# EAGLE design backplane (EAGLE 5.06)
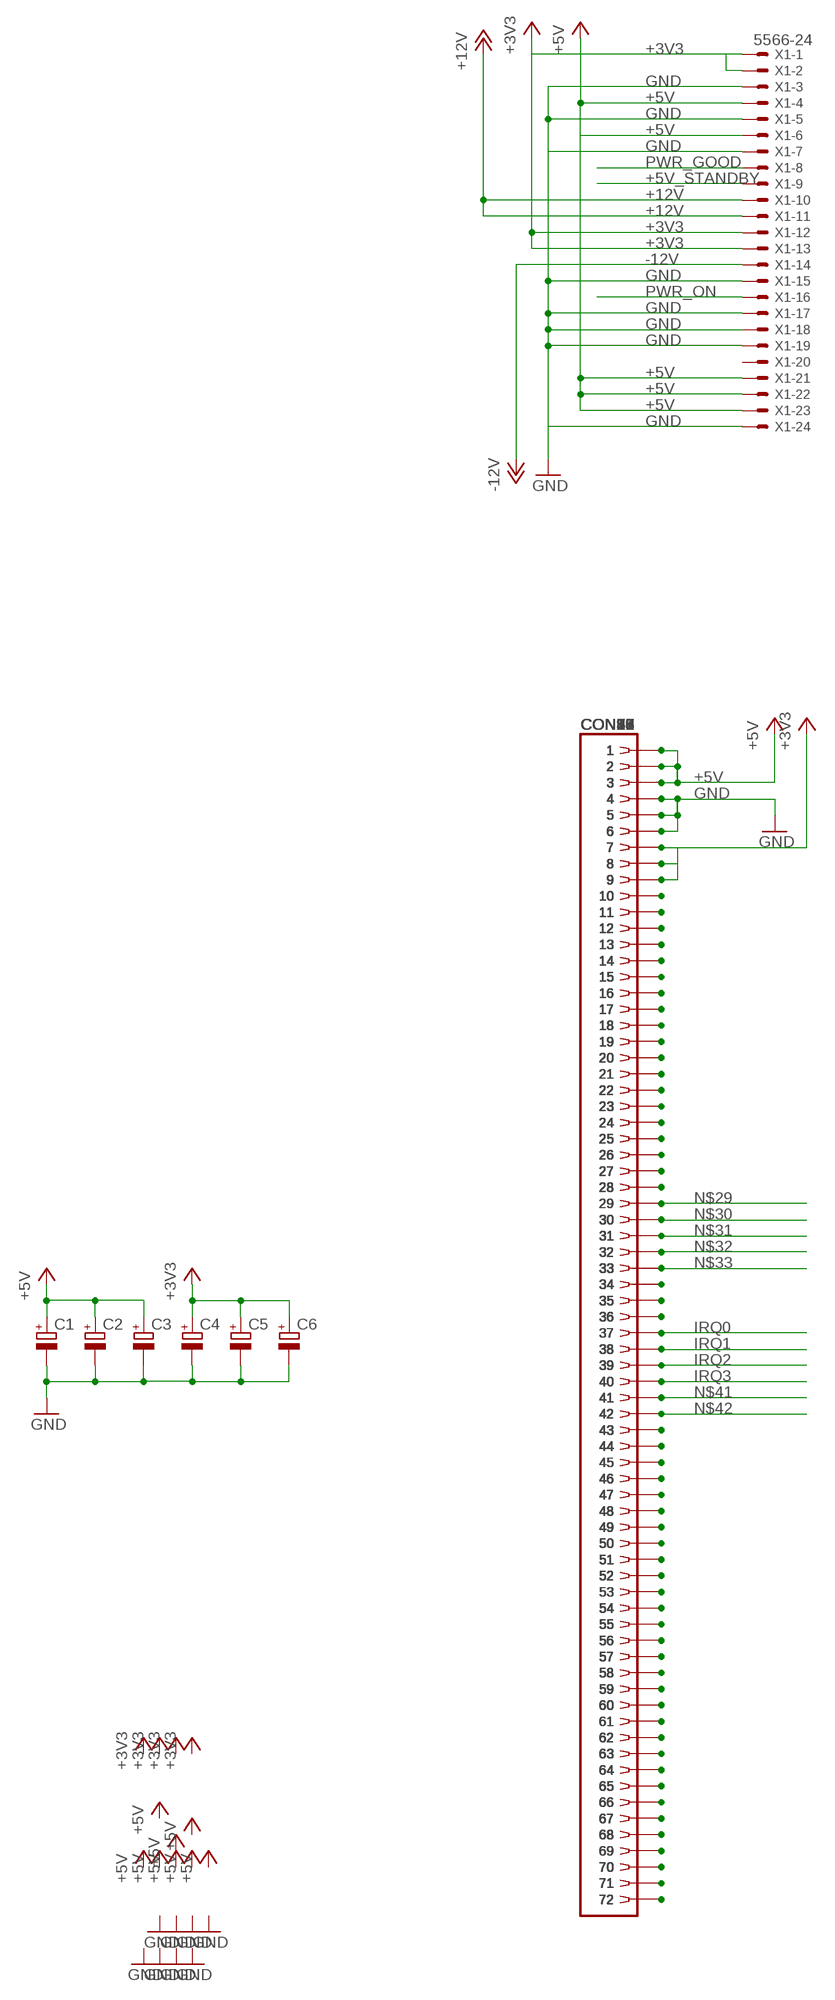
[diagram p0: schematic, sheet 1]

## Parts
C1  CPOL-EUE3.5-10  [E3,5-10]
C2  CPOL-EUE2.5-6  [E2,5-6]
C3  CPOL-EUE2.5-6  [E2,5-6]
C4  CPOL-EUE3.5-10  [E3,5-10]
C5  CPOL-EUE2.5-6  [E2,5-6]
C6  CPOL-EUE2.5-6  [E2,5-6]
CON1  SIMM72  [73826962]
CON2  SIMM72  [73826962]
CON3  SIMM72  [73826962]
CON4  SIMM72  [73826962]
CON5  SIMM72  [73826962]
CON6  SIMM72  [73826962]
CON7  SIMM72  [73826962]
CON8  SIMM72  [73826962]
CON9  SIMM72  [73826962]
CON10  SIMM72  [73826962]
CON11  SIMM72  [73826962]
CON12  SIMM72  [73826962]
CON13  SIMM72  [73826962]
CON14  SIMM72  [73826962]
CON15  SIMM72  [73826962]
CON16  SIMM72  [73826962]
CON17  SIMM72  [73826962]
CON18  SIMM72  [73826962]
CON19  SIMM72  [73826962]
CON20  SIMM72  [73826962]
X1  5566-24  [5566-24]

## Nets
+3V3: C4.+ C5.+ C6.+ CON1.7 CON1.8 CON1.9 CON2.7 CON2.8 CON2.9 CON3.7 CON3.8 CON3.9 CON4.7 CON4.8 CON4.9 CON5.7 CON5.8 CON5.9 CON6.7 CON6.8 CON6.9 CON7.7 CON7.8 CON7.9 CON8.7 CON8.8 CON8.9 CON9.7 CON9.8 CON9.9 CON10.7 CON10.8 CON10.9 CON11.7 CON11.8 CON11.9 CON12.7 CON12.8 CON12.9 CON13.7 CON13.8 CON13.9 CON14.7 CON14.8 CON14.9 CON15.7 CON15.8 CON15.9 CON16.7 CON16.8 CON16.9 CON17.7 CON17.8 CON17.9 CON18.7 CON18.8 CON18.9 CON19.7 CON19.8 CON19.9 CON20.7 CON20.8 CON20.9 X1.1 X1.2 X1.12 X1.13
+5V: C1.+ C2.+ C3.+ CON1.1 CON1.2 CON1.3 CON2.1 CON2.2 CON2.3 CON3.1 CON3.2 CON3.3 CON4.1 CON4.2 CON4.3 CON5.1 CON5.2 CON5.3 CON6.1 CON6.2 CON6.3 CON7.1 CON7.2 CON7.3 CON8.1 CON8.2 CON8.3 CON9.1 CON9.2 CON9.3 CON10.1 CON10.2 CON10.3 CON11.1 CON11.2 CON11.3 CON12.1 CON12.2 CON12.3 CON13.1 CON13.2 CON13.3 CON14.1 CON14.2 CON14.3 CON15.1 CON15.2 CON15.3 CON16.1 CON16.2 CON16.3 CON17.1 CON17.2 CON17.3 CON18.1 CON18.2 CON18.3 CON19.1 CON19.2 CON19.3 CON20.1 CON20.2 CON20.3 X1.4 X1.6 X1.21 X1.22 X1.23
+5V_STANDBY: X1.9
+12V: X1.10 X1.11
-12V: X1.14
GND: C1.- C2.- C3.- C4.- C5.- C6.- CON1.4 CON1.5 CON1.6 CON2.4 CON2.5 CON2.6 CON3.4 CON3.5 CON3.6 CON4.4 CON4.5 CON4.6 CON5.4 CON5.5 CON5.6 CON6.4 CON6.5 CON6.6 CON7.4 CON7.5 CON7.6 CON8.4 CON8.5 CON8.6 CON9.4 CON9.5 CON9.6 CON10.4 CON10.5 CON10.6 CON11.4 CON11.5 CON11.6 CON12.4 CON12.5 CON12.6 CON13.4 CON13.5 CON13.6 CON14.4 CON14.5 CON14.6 CON15.4 CON15.5 CON15.6 CON16.4 CON16.5 CON16.6 CON17.4 CON17.5 CON17.6 CON18.4 CON18.5 CON18.6 CON19.4 CON19.5 CON19.6 CON20.4 CON20.5 CON20.6 X1.3 X1.5 X1.7 X1.15 X1.17 X1.18 X1.19 X1.24
IRQ0: CON1.37 CON2.37 CON3.37 CON4.37 CON5.37 CON6.37 CON7.37 CON8.37 CON9.37 CON10.37 CON11.37 CON12.37 CON13.37 CON14.37 CON15.37 CON16.37 CON17.37 CON18.37 CON19.37 CON20.37
IRQ1: CON1.38 CON2.38 CON3.38 CON4.38 CON5.38 CON6.38 CON7.38 CON8.38 CON9.38 CON10.38 CON11.38 CON12.38 CON13.38 CON14.38 CON15.38 CON16.38 CON17.38 CON18.38 CON19.38 CON20.38
IRQ2: CON1.39 CON2.39 CON3.39 CON4.39 CON5.39 CON6.39 CON7.39 CON8.39 CON9.39 CON10.39 CON11.39 CON12.39 CON13.39 CON14.39 CON15.39 CON16.39 CON17.39 CON18.39 CON19.39 CON20.39
IRQ3: CON1.40 CON2.40 CON3.40 CON4.40 CON5.40 CON6.40 CON7.40 CON8.40 CON9.40 CON10.40 CON11.40 CON12.40 CON13.40 CON14.40 CON15.40 CON16.40 CON17.40 CON18.40 CON19.40 CON20.40
N$10: CON1.10 CON2.10 CON3.10 CON4.10 CON5.10 CON6.10 CON7.10 CON8.10 CON9.10 CON10.10 CON11.10 CON12.10 CON13.10 CON14.10 CON15.10 CON16.10 CON17.10 CON18.10 CON19.10 CON20.10
N$11: CON1.11 CON2.11 CON3.11 CON4.11 CON5.11 CON6.11 CON7.11 CON8.11 CON9.11 CON10.11 CON11.11 CON12.11 CON13.11 CON14.11 CON15.11 CON16.11 CON17.11 CON18.11 CON19.11 CON20.11
N$12: CON1.12 CON2.12 CON3.12 CON4.12 CON5.12 CON6.12 CON7.12 CON8.12 CON9.12 CON10.12 CON11.12 CON12.12 CON13.12 CON14.12 CON15.12 CON16.12 CON17.12 CON18.12 CON19.12 CON20.12
N$13: CON1.13 CON2.13 CON3.13 CON4.13 CON5.13 CON6.13 CON7.13 CON8.13 CON9.13 CON10.13 CON11.13 CON12.13 CON13.13 CON14.13 CON15.13 CON16.13 CON17.13 CON18.13 CON19.13 CON20.13
N$14: CON1.14 CON2.14 CON3.14 CON4.14 CON5.14 CON6.14 CON7.14 CON8.14 CON9.14 CON10.14 CON11.14 CON12.14 CON13.14 CON14.14 CON15.14 CON16.14 CON17.14 CON18.14 CON19.14 CON20.14
N$15: CON1.15 CON2.15 CON3.15 CON4.15 CON5.15 CON6.15 CON7.15 CON8.15 CON9.15 CON10.15 CON11.15 CON12.15 CON13.15 CON14.15 CON15.15 CON16.15 CON17.15 CON18.15 CON19.15 CON20.15
N$16: CON1.16 CON2.16 CON3.16 CON4.16 CON5.16 CON6.16 CON7.16 CON8.16 CON9.16 CON10.16 CON11.16 CON12.16 CON13.16 CON14.16 CON15.16 CON16.16 CON17.16 CON18.16 CON19.16 CON20.16
N$17: CON1.17 CON2.17 CON3.17 CON4.17 CON5.17 CON6.17 CON7.17 CON8.17 CON9.17 CON10.17 CON11.17 CON12.17 CON13.17 CON14.17 CON15.17 CON16.17 CON17.17 CON18.17 CON19.17 CON20.17
N$18: CON1.18 CON2.18 CON3.18 CON4.18 CON5.18 CON6.18 CON7.18 CON8.18 CON9.18 CON10.18 CON11.18 CON12.18 CON13.18 CON14.18 CON15.18 CON16.18 CON17.18 CON18.18 CON19.18 CON20.18
N$19: CON1.19 CON2.19 CON3.19 CON4.19 CON5.19 CON6.19 CON7.19 CON8.19 CON9.19 CON10.19 CON11.19 CON12.19 CON13.19 CON14.19 CON15.19 CON16.19 CON17.19 CON18.19 CON19.19 CON20.19
N$20: CON1.20 CON2.20 CON3.20 CON4.20 CON5.20 CON6.20 CON7.20 CON8.20 CON9.20 CON10.20 CON11.20 CON12.20 CON13.20 CON14.20 CON15.20 CON16.20 CON17.20 CON18.20 CON19.20 CON20.20
N$21: CON1.21 CON2.21 CON3.21 CON4.21 CON5.21 CON6.21 CON7.21 CON8.21 CON9.21 CON10.21 CON11.21 CON12.21 CON13.21 CON14.21 CON15.21 CON16.21 CON17.21 CON18.21 CON19.21 CON20.21
N$22: CON1.22 CON2.22 CON3.22 CON4.22 CON5.22 CON6.22 CON7.22 CON8.22 CON9.22 CON10.22 CON11.22 CON12.22 CON13.22 CON14.22 CON15.22 CON16.22 CON17.22 CON18.22 CON19.22 CON20.22
N$23: CON1.23 CON2.23 CON3.23 CON4.23 CON5.23 CON6.23 CON7.23 CON8.23 CON9.23 CON10.23 CON11.23 CON12.23 CON13.23 CON14.23 CON15.23 CON16.23 CON17.23 CON18.23 CON19.23 CON20.23
N$24: CON1.24 CON2.24 CON3.24 CON4.24 CON5.24 CON6.24 CON7.24 CON8.24 CON9.24 CON10.24 CON11.24 CON12.24 CON13.24 CON14.24 CON15.24 CON16.24 CON17.24 CON18.24 CON19.24 CON20.24
N$25: CON1.25 CON2.25 CON3.25 CON4.25 CON5.25 CON6.25 CON7.25 CON8.25 CON9.25 CON10.25 CON11.25 CON12.25 CON13.25 CON14.25 CON15.25 CON16.25 CON17.25 CON18.25 CON19.25 CON20.25
N$26: CON1.26 CON2.26 CON3.26 CON4.26 CON5.26 CON6.26 CON7.26 CON8.26 CON9.26 CON10.26 CON11.26 CON12.26 CON13.26 CON14.26 CON15.26 CON16.26 CON17.26 CON18.26 CON19.26 CON20.26
N$27: CON1.27 CON2.27 CON3.27 CON4.27 CON5.27 CON6.27 CON7.27 CON8.27 CON9.27 CON10.27 CON11.27 CON12.27 CON13.27 CON14.27 CON15.27 CON16.27 CON17.27 CON18.27 CON19.27 CON20.27
N$28: CON1.28 CON2.28 CON3.28 CON4.28 CON5.28 CON6.28 CON7.28 CON8.28 CON9.28 CON10.28 CON11.28 CON12.28 CON13.28 CON14.28 CON15.28 CON16.28 CON17.28 CON18.28 CON19.28 CON20.28
N$29: CON1.29 CON2.29 CON3.29 CON4.29 CON5.29 CON6.29 CON7.29 CON8.29 CON9.29 CON10.29 CON11.29 CON12.29 CON13.29 CON14.29 CON15.29 CON16.29 CON17.29 CON18.29 CON19.29 CON20.29
N$30: CON1.30 CON2.30 CON3.30 CON4.30 CON5.30 CON6.30 CON7.30 CON8.30 CON9.30 CON10.30 CON11.30 CON12.30 CON13.30 CON14.30 CON15.30 CON16.30 CON17.30 CON18.30 CON19.30 CON20.30
N$31: CON1.31 CON2.31 CON3.31 CON4.31 CON5.31 CON6.31 CON7.31 CON8.31 CON9.31 CON10.31 CON11.31 CON12.31 CON13.31 CON14.31 CON15.31 CON16.31 CON17.31 CON18.31 CON19.31 CON20.31
N$32: CON1.32 CON2.32 CON3.32 CON4.32 CON5.32 CON6.32 CON7.32 CON8.32 CON9.32 CON10.32 CON11.32 CON12.32 CON13.32 CON14.32 CON15.32 CON16.32 CON17.32 CON18.32 CON19.32 CON20.32
N$33: CON1.33 CON2.33 CON3.33 CON4.33 CON5.33 CON6.33 CON7.33 CON8.33 CON9.33 CON10.33 CON11.33 CON12.33 CON13.33 CON14.33 CON15.33 CON16.33 CON17.33 CON18.33 CON19.33 CON20.33
N$34: CON1.34 CON2.34 CON3.34 CON4.34 CON5.34 CON6.34 CON7.34 CON8.34 CON9.34 CON10.34 CON11.34 CON12.34 CON13.34 CON14.34 CON15.34 CON16.34 CON17.34 CON18.34 CON19.34 CON20.34
N$35: CON1.35 CON2.35 CON3.35 CON4.35 CON5.35 CON6.35 CON7.35 CON8.35 CON9.35 CON10.35 CON11.35 CON12.35 CON13.35 CON14.35 CON15.35 CON16.35 CON17.35 CON18.35 CON19.35 CON20.35
N$36: CON1.36 CON2.36 CON3.36 CON4.36 CON5.36 CON6.36 CON7.36 CON8.36 CON9.36 CON10.36 CON11.36 CON12.36 CON13.36 CON14.36 CON15.36 CON16.36 CON17.36 CON18.36 CON19.36 CON20.36
N$41: CON1.41 CON2.41 CON3.41 CON4.41 CON5.41 CON6.41 CON7.41 CON8.41 CON9.41 CON10.41 CON11.41 CON12.41 CON13.41 CON14.41 CON15.41 CON16.41 CON17.41 CON18.41 CON19.41 CON20.41
N$42: CON1.42 CON2.42 CON3.42 CON4.42 CON5.42 CON6.42 CON7.42 CON8.42 CON9.42 CON10.42 CON11.42 CON12.42 CON13.42 CON14.42 CON15.42 CON16.42 CON17.42 CON18.42 CON19.42 CON20.42
N$43: CON1.43 CON2.43 CON3.43 CON4.43 CON5.43 CON6.43 CON7.43 CON8.43 CON9.43 CON10.43 CON11.43 CON12.43 CON13.43 CON14.43 CON15.43 CON16.43 CON17.43 CON18.43 CON19.43 CON20.43
N$44: CON1.44 CON2.44 CON3.44 CON4.44 CON5.44 CON6.44 CON7.44 CON8.44 CON9.44 CON10.44 CON11.44 CON12.44 CON13.44 CON14.44 CON15.44 CON16.44 CON17.44 CON18.44 CON19.44 CON20.44
N$45: CON1.45 CON2.45 CON3.45 CON4.45 CON5.45 CON6.45 CON7.45 CON8.45 CON9.45 CON10.45 CON11.45 CON12.45 CON13.45 CON14.45 CON15.45 CON16.45 CON17.45 CON18.45 CON19.45 CON20.45
N$46: CON1.46 CON2.46 CON3.46 CON4.46 CON5.46 CON6.46 CON7.46 CON8.46 CON9.46 CON10.46 CON11.46 CON12.46 CON13.46 CON14.46 CON15.46 CON16.46 CON17.46 CON18.46 CON19.46 CON20.46
N$47: CON1.47 CON2.47 CON3.47 CON4.47 CON5.47 CON6.47 CON7.47 CON8.47 CON9.47 CON10.47 CON11.47 CON12.47 CON13.47 CON14.47 CON15.47 CON16.47 CON17.47 CON18.47 CON19.47 CON20.47
N$48: CON1.48 CON2.48 CON3.48 CON4.48 CON5.48 CON6.48 CON7.48 CON8.48 CON9.48 CON10.48 CON11.48 CON12.48 CON13.48 CON14.48 CON15.48 CON16.48 CON17.48 CON18.48 CON19.48 CON20.48
N$49: CON1.49 CON2.49 CON3.49 CON4.49 CON5.49 CON6.49 CON7.49 CON8.49 CON9.49 CON10.49 CON11.49 CON12.49 CON13.49 CON14.49 CON15.49 CON16.49 CON17.49 CON18.49 CON19.49 CON20.49
N$50: CON1.50 CON2.50 CON3.50 CON4.50 CON5.50 CON6.50 CON7.50 CON8.50 CON9.50 CON10.50 CON11.50 CON12.50 CON13.50 CON14.50 CON15.50 CON16.50 CON17.50 CON18.50 CON19.50 CON20.50
N$51: CON1.51 CON2.51 CON3.51 CON4.51 CON5.51 CON6.51 CON7.51 CON8.51 CON9.51 CON10.51 CON11.51 CON12.51 CON13.51 CON14.51 CON15.51 CON16.51 CON17.51 CON18.51 CON19.51 CON20.51
N$52: CON1.52 CON2.52 CON3.52 CON4.52 CON5.52 CON6.52 CON7.52 CON8.52 CON9.52 CON10.52 CON11.52 CON12.52 CON13.52 CON14.52 CON15.52 CON16.52 CON17.52 CON18.52 CON19.52 CON20.52
N$53: CON1.53 CON2.53 CON3.53 CON4.53 CON5.53 CON6.53 CON7.53 CON8.53 CON9.53 CON10.53 CON11.53 CON12.53 CON13.53 CON14.53 CON15.53 CON16.53 CON17.53 CON18.53 CON19.53 CON20.53
N$54: CON1.54 CON2.54 CON3.54 CON4.54 CON5.54 CON6.54 CON7.54 CON8.54 CON9.54 CON10.54 CON11.54 CON12.54 CON13.54 CON14.54 CON15.54 CON16.54 CON17.54 CON18.54 CON19.54 CON20.54
N$55: CON1.55 CON2.55 CON3.55 CON4.55 CON5.55 CON6.55 CON7.55 CON8.55 CON9.55 CON10.55 CON11.55 CON12.55 CON13.55 CON14.55 CON15.55 CON16.55 CON17.55 CON18.55 CON19.55 CON20.55
N$56: CON1.56 CON2.56 CON3.56 CON4.56 CON5.56 CON6.56 CON7.56 CON8.56 CON9.56 CON10.56 CON11.56 CON12.56 CON13.56 CON14.56 CON15.56 CON16.56 CON17.56 CON18.56 CON19.56 CON20.56
N$57: CON1.57 CON2.57 CON3.57 CON4.57 CON5.57 CON6.57 CON7.57 CON8.57 CON9.57 CON10.57 CON11.57 CON12.57 CON13.57 CON14.57 CON15.57 CON16.57 CON17.57 CON18.57 CON19.57 CON20.57
N$58: CON1.58 CON2.58 CON3.58 CON4.58 CON5.58 CON6.58 CON7.58 CON8.58 CON9.58 CON10.58 CON11.58 CON12.58 CON13.58 CON14.58 CON15.58 CON16.58 CON17.58 CON18.58 CON19.58 CON20.58
N$59: CON1.59 CON2.59 CON3.59 CON4.59 CON5.59 CON6.59 CON7.59 CON8.59 CON9.59 CON10.59 CON11.59 CON12.59 CON13.59 CON14.59 CON15.59 CON16.59 CON17.59 CON18.59 CON19.59 CON20.59
N$60: CON1.60 CON2.60 CON3.60 CON4.60 CON5.60 CON6.60 CON7.60 CON8.60 CON9.60 CON10.60 CON11.60 CON12.60 CON13.60 CON14.60 CON15.60 CON16.60 CON17.60 CON18.60 CON19.60 CON20.60
N$61: CON1.61 CON2.61 CON3.61 CON4.61 CON5.61 CON6.61 CON7.61 CON8.61 CON9.61 CON10.61 CON11.61 CON12.61 CON13.61 CON14.61 CON15.61 CON16.61 CON17.61 CON18.61 CON19.61 CON20.61
N$62: CON1.62 CON2.62 CON3.62 CON4.62 CON5.62 CON6.62 CON7.62 CON8.62 CON9.62 CON10.62 CON11.62 CON12.62 CON13.62 CON14.62 CON15.62 CON16.62 CON17.62 CON18.62 CON19.62 CON20.62
N$63: CON1.63 CON2.63 CON3.63 CON4.63 CON5.63 CON6.63 CON7.63 CON8.63 CON9.63 CON10.63 CON11.63 CON12.63 CON13.63 CON14.63 CON15.63 CON16.63 CON17.63 CON18.63 CON19.63 CON20.63
N$64: CON1.64 CON2.64 CON3.64 CON4.64 CON5.64 CON6.64 CON7.64 CON8.64 CON9.64 CON10.64 CON11.64 CON12.64 CON13.64 CON14.64 CON15.64 CON16.64 CON17.64 CON18.64 CON19.64 CON20.64
N$65: CON1.65 CON2.65 CON3.65 CON4.65 CON5.65 CON6.65 CON7.65 CON8.65 CON9.65 CON10.65 CON11.65 CON12.65 CON13.65 CON14.65 CON15.65 CON16.65 CON17.65 CON18.65 CON19.65 CON20.65
N$66: CON1.66 CON2.66 CON3.66 CON4.66 CON5.66 CON6.66 CON7.66 CON8.66 CON9.66 CON10.66 CON11.66 CON12.66 CON13.66 CON14.66 CON15.66 CON16.66 CON17.66 CON18.66 CON19.66 CON20.66
N$67: CON1.67 CON2.67 CON3.67 CON4.67 CON5.67 CON6.67 CON7.67 CON8.67 CON9.67 CON10.67 CON11.67 CON12.67 CON13.67 CON14.67 CON15.67 CON16.67 CON17.67 CON18.67 CON19.67 CON20.67
N$68: CON1.68 CON2.68 CON3.68 CON4.68 CON5.68 CON6.68 CON7.68 CON8.68 CON9.68 CON10.68 CON11.68 CON12.68 CON13.68 CON14.68 CON15.68 CON16.68 CON17.68 CON18.68 CON19.68 CON20.68
N$69: CON1.69 CON2.69 CON3.69 CON4.69 CON5.69 CON6.69 CON7.69 CON8.69 CON9.69 CON10.69 CON11.69 CON12.69 CON13.69 CON14.69 CON15.69 CON16.69 CON17.69 CON18.69 CON19.69 CON20.69
N$70: CON1.70 CON2.70 CON3.70 CON4.70 CON5.70 CON6.70 CON7.70 CON8.70 CON9.70 CON10.70 CON11.70 CON12.70 CON13.70 CON14.70 CON15.70 CON16.70 CON17.70 CON18.70 CON19.70 CON20.70
N$71: CON1.71 CON2.71 CON3.71 CON4.71 CON5.71 CON6.71 CON7.71 CON8.71 CON9.71 CON10.71 CON11.71 CON12.71 CON13.71 CON14.71 CON15.71 CON16.71 CON17.71 CON18.71 CON19.71 CON20.71
N$72: CON1.72 CON2.72 CON3.72 CON4.72 CON5.72 CON6.72 CON7.72 CON8.72 CON9.72 CON10.72 CON11.72 CON12.72 CON13.72 CON14.72 CON15.72 CON16.72 CON17.72 CON18.72 CON19.72 CON20.72
PWR_GOOD: X1.8
PWR_ON: X1.16
Unconnected: X1.20

## Library data of the parts
C1-C6 = rcl:CPOL-EU: POLARIZED CAPACITOR, European symbol
CON1-CON20 = con-amp:SIMM72: AMP connector
X1 = con-molex:5566-24: Mini FIT connector 24 pol Source: http://www.molex.com

## Board
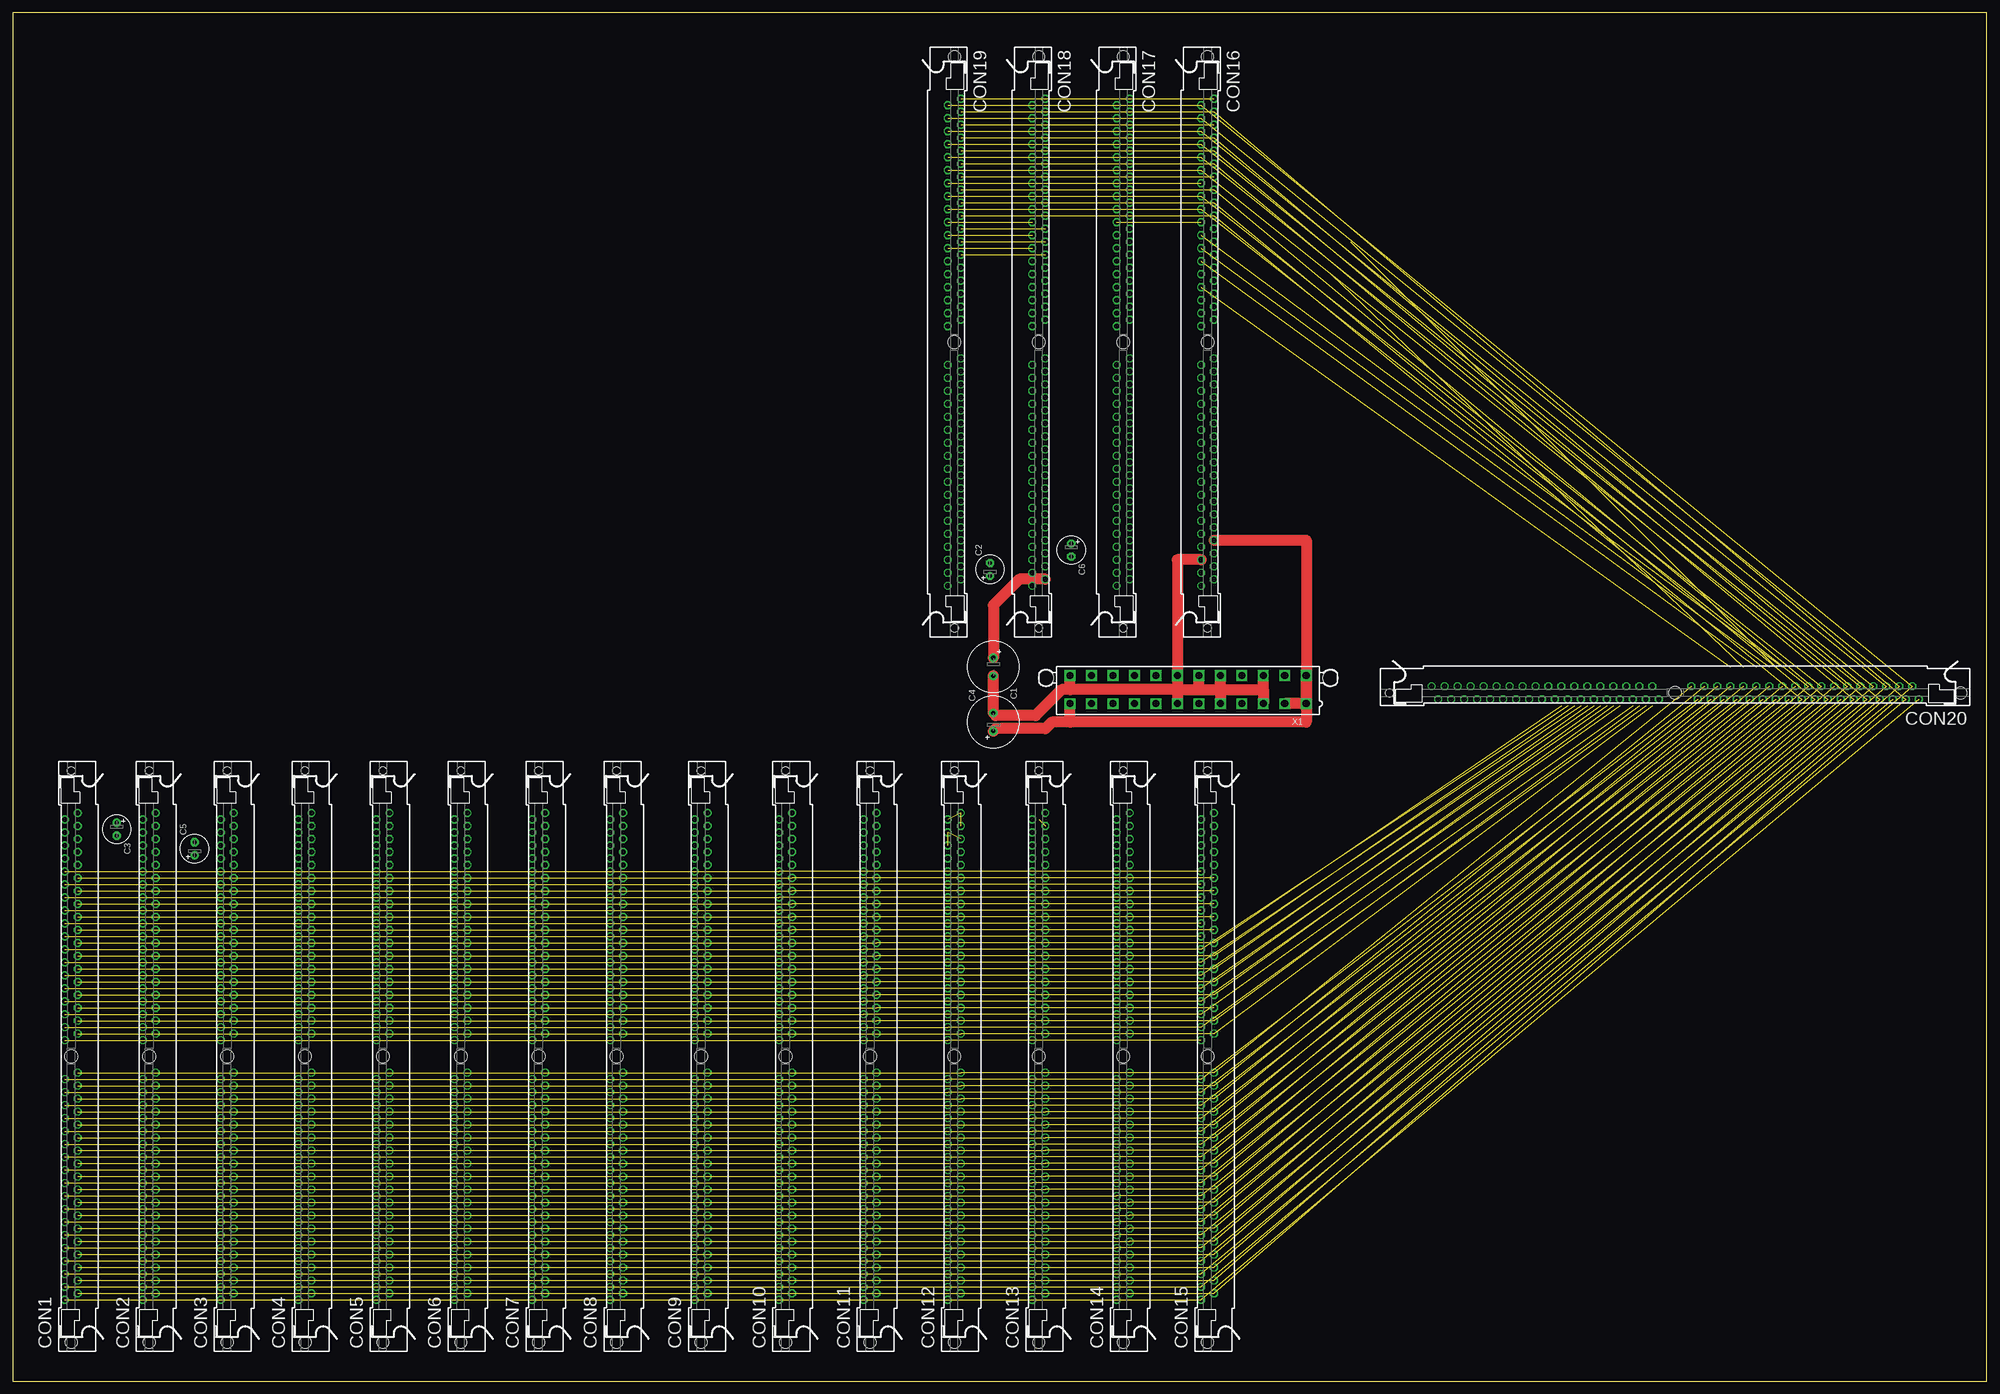
[diagram p1: board, top side]
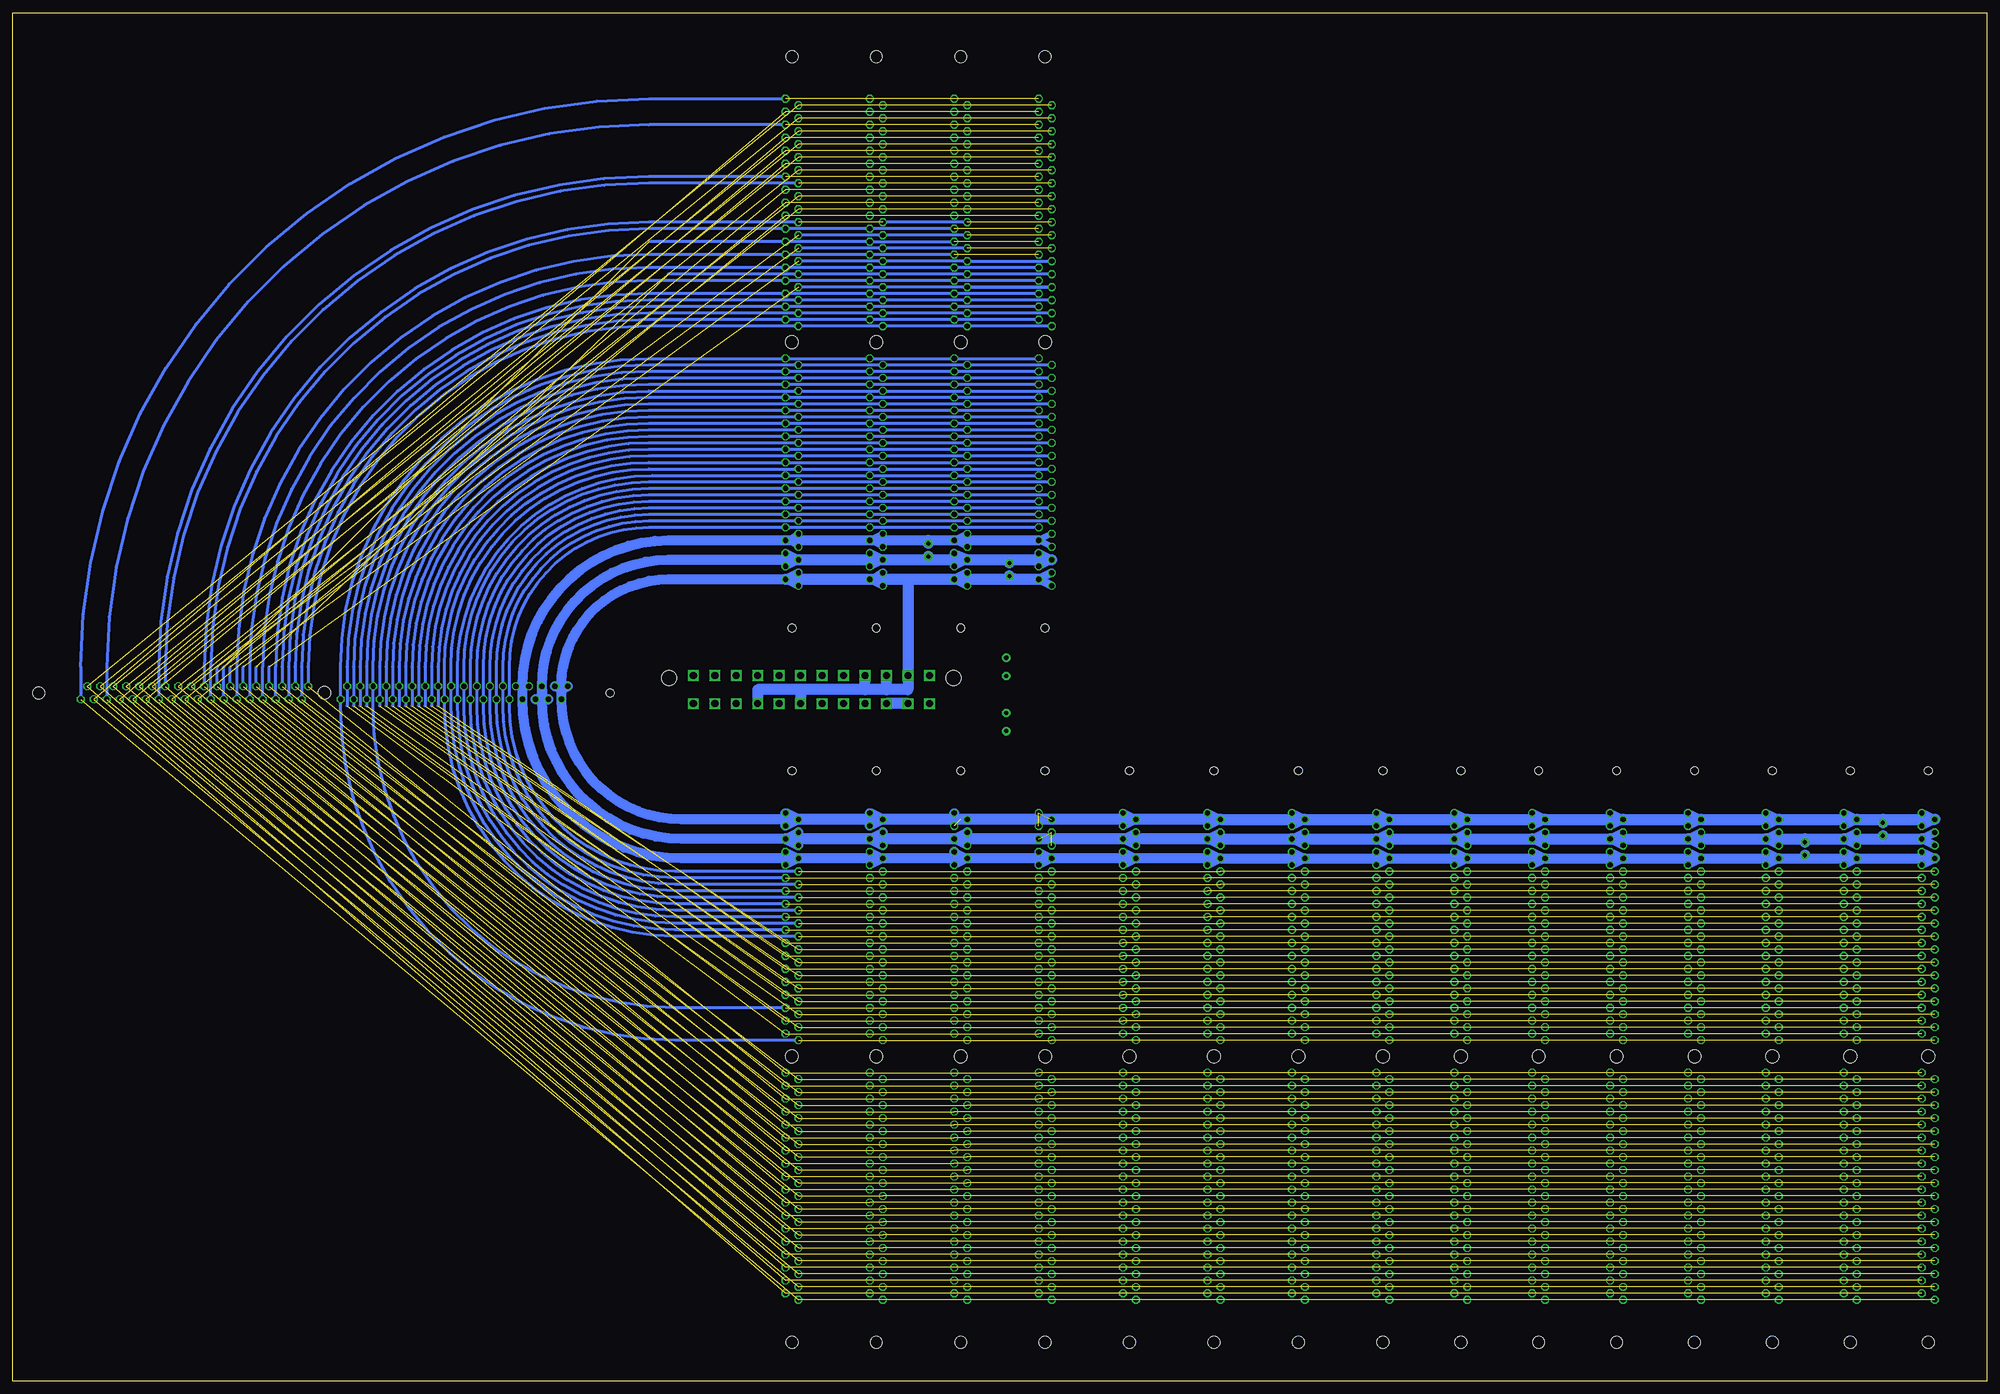
[diagram p2: board, bottom side, seen from below]

Size 386.06 x 267.64 mm. Coordinates in mm from the lower left corner, seen from the top.
Outline: 0,0 386.06,0 386.06,267.64 0,267.64 0,0
Copper layers (1*16): Top 0.035mm / dielectric 1.5mm / Bottom 0.035mm
Design rules "default": minimum track width 10mil, minimum drill 24mil, track to track 8mil, track to pad 8mil, pad to pad 8mil, via to via 8mil, smd to smd 8mil, copper to edge 40mil, drill to drill 8mil, minimum pad ring 10mil, minimum via ring 8mil, stop-mask expansion 4mil, vias tented up to drill 0mil, thermal gap 10mil

### Footprints (pad centres in the part's own frame; a part is rotated, then mirrored left to right if it is on the bottom)
E3,5-10 = drill 0.813 pad 1.6 round: + -1.778,0 | drill 0.813 pad 1.6 octagon: - 1.778,0
E2,5-6 = drill 0.813 pad 1.6 round: + -1.27,0 | drill 0.813 pad 1.6 octagon: - 1.27,0
73826962 = drill 1.016 round: 1 47.625,-1.27 | drill 1.016 octagon: 2 46.355,1.27; 3 45.085,-1.27; 4 43.815,1.27; 5 42.545,-1.27; 6 41.275,1.27; 7 40.005,-1.27; 8 38.735,1.27; 9 37.465,-1.27; 10 36.195,1.27; 11 34.925,-1.27; 12 33.655,1.27; 13 32.385,-1.27; 14 31.115,1.27; 15 29.845,-1.27; 16 28.575,1.27; 17 27.305,-1.27; 18 26.035,1.27; 19 24.765,-1.27; 20 23.495,1.27; 21 22.225,-1.27; 22 20.955,1.27; 23 19.685,-1.27; 24 18.415,1.27; 25 17.145,-1.27; 26 15.875,1.27; 27 14.605,-1.27; 28 13.335,1.27; 29 12.065,-1.27; 30 10.795,1.27; 31 9.525,-1.27; 32 8.255,1.27; 33 6.985,-1.27; 34 5.715,1.27; 35 4.445,-1.27; 36 3.175,1.27; 37 -3.175,-1.27; 38 -4.445,1.27; 39 -5.715,-1.27; 40 -6.985,1.27; 41 -8.255,-1.27; 42 -9.525,1.27; 43 -10.795,-1.27; 44 -12.065,1.27; 45 -13.335,-1.27; 46 -14.605,1.27; 47 -15.875,-1.27; 48 -17.145,1.27; 49 -18.415,-1.27; 50 -19.685,1.27; 51 -20.955,-1.27; 52 -22.225,1.27; 53 -23.495,-1.27; 54 -24.765,1.27; 55 -26.035,-1.27; 56 -27.305,1.27; 57 -28.575,-1.27; 58 -29.845,1.27; 59 -31.115,-1.27; 60 -32.385,1.27; 61 -33.655,-1.27; 62 -34.925,1.27; 63 -36.195,-1.27; 64 -37.465,1.27; 65 -38.735,-1.27; 66 -40.005,1.27; 67 -41.275,-1.27; 68 -42.545,1.27; 69 -43.815,-1.27; 70 -45.085,1.27; 71 -46.355,-1.27; 72 -47.625,1.27 | hole 2.362: -55.88,0 | hole 1.575: 55.88,0 | hole 2.54: 0,0
5566-24 = drill 1.4 square: 1 23.1,-2.75; 2 18.9,-2.75; 3 14.7,-2.75; 4 10.5,-2.75; 5 6.3,-2.75; 6 2.1,-2.75; 7 -2.1,-2.75; 8 -6.3,-2.75; 9 -10.5,-2.75; 10 -14.7,-2.75; 11 -18.9,-2.75; 12 -23.1,-2.75; 13 23.1,2.75; 14 18.9,2.75; 15 14.7,2.75; 16 10.5,2.75; 17 6.3,2.75; 18 2.1,2.75; 19 -2.1,2.75; 20 -6.3,2.75; 21 -10.5,2.75; 22 -14.7,2.75; 23 -18.9,2.75; 24 -23.1,2.75 | hole 3: 27.8,2.29; -27.8,2.29

### Placement (x,y rotation side)
C1  191.77,139.7 270 top
C2  191.13,158.75 90 top
C3  20.32,107.95 270 top
C4  191.77,128.91 90 top
C5  35.56,104.14 90 top
C6  207.01,162.56 270 top
CON1  11.43,63.5 90 top
CON2  26.67,63.5 90 top
CON3  41.91,63.5 90 top
CON4  57.15,63.5 90 top
CON5  72.39,63.5 90 top
CON6  87.63,63.5 90 top
CON7  102.87,63.5 90 top
CON8  118.11,63.5 90 top
CON9  134.62,63.5 90 top
CON10  151.13,63.5 90 top
CON11  167.64,63.5 90 top
CON12  184.15,63.5 90 top
CON13  200.66,63.5 90 top
CON14  217.17,63.5 90 top
CON15  233.68,63.5 90 top
CON16  233.68,203.2 270 top
CON17  217.17,203.2 270 top
CON18  200.66,203.2 270 top
CON19  184.15,203.2 270 top
CON20  325.12,134.62 180 top
X1  229.87,135.25 0 top

### Tracks (layer width: path | path; a pad name or v marks a point on that pad's centre or on a via)
+3V3
  Top 2.184: X1.1 X1.13 | X1.1 X1.2 | X1.1 252.97,164.47 CON16.8 | X1.1 252.97,128.91 206.77,128.91 | 206.77,128.91 X1.12 | 206.77,128.91 203.2,128.91 201.93,127.64 192.28,127.64 C4.+
  Bottom 1.27: CON18.9 CON18.8 CON18.7 | CON17.9 CON17.8 CON17.7 | CON16.9 234.31,164.47 CON16.7 | CON19.9 CON19.8 CON19.7
  Bottom 1.422: CON20.7 286.38,135.89 CON20.9
  Bottom 1.676: CON7.7 CON7.8 CON7.9 | CON6.7 CON6.8 CON6.9 | CON1.7 CON1.8 CON1.9 | CON2.7 CON2.8 CON2.9 | CON3.7 CON3.8 CON3.9 | CON4.7 CON4.8 CON4.9 | CON5.7 CON5.8 CON5.9 | CON8.7 CON8.8 CON8.9 | CON9.7 CON9.8 CON9.9 | CON10.9 CON10.8 CON10.7 | CON11.7 CON11.8 CON11.9 | CON12.7 CON12.8 CON12.9 | CON13.7 CON13.8 CON13.9 | CON14.7 CON14.8 CON14.9 | CON15.7 CON15.8 CON15.9
  Bottom 1.93: CON1.8 CON2.8 35.56,102.23 CON3.8 CON4.8 CON5.8 CON6.8 CON7.8 CON8.8 CON9.8 CON10.8 CON11.8 CON12.8 CON13.8 201.29,102.23 | 201.93,102.23 CON14.8 CON15.8 | CON19.8 CON18.8 207.01,164.47 CON17.8 234.31,164.47 CON16.8 257.81,164.47 arc-90 286.38,135.89 CON20.8 | 201.29,102.23 arc90 201.93,102.87 CON13.7 201.93,102.23 | 201.29,102.23 201.93,102.23 | 255.27,102.23 arc90 CON20.8 | 201.93,102.23 255.27,102.23 | 255.27,102.23 arc90 CON20.8
  Bottom 2.184: 207.01,164.47 C6.+ | 35.56,102.23 C5.+
+5V  (3 unrouted)
  Top 2.184: C1.+ 191.77,151.76 196.85,156.84 CON18.2
  Bottom 1.676: CON1.1 CON1.2 CON1.3 | CON2.3 CON2.2 CON2.1 | CON3.1 CON3.2 CON3.3 | CON5.1 CON5.2 CON5.3 | CON4.3 CON4.2 CON4.1 | CON6.1 CON6.2 CON6.3 | CON7.3 CON7.2 CON7.1 | CON9.1 CON9.2 CON9.3 | CON10.1 CON10.2 CON10.3 | CON11.3 CON11.2 CON11.1 | CON8.1 CON8.2 CON8.3 | CON16.3 CON16.2 CON16.1 | CON18.3 CON18.2 CON18.1 | CON19.3 CON19.2 CON19.1 | 217.81,156.84 CON17.3 | CON17.2 CON17.1
  Bottom 1.93: 278.76,134.62 arc90 CON20.1 | 278.76,134.62 arc-90 CON20.3 | CON20.2 278.76,134.62 | CON20.2 278.76,135.89 arc90 257.81,156.84 CON16.2 | CON15.2 255.27,109.86 arc90 CON20.2 | CON15.2 CON15.3 | CON15.2 CON15.1 | CON14.3 CON14.2 CON14.1 | CON13.2 200.66,109.86 arc90 CON13.1
  Bottom 2.184: CON15.2 CON14.2 CON13.2 CON12.2 CON11.2 CON10.2 CON9.2 | CON9.2 135.89,109.86 | CON9.2 CON8.2 CON7.2 CON6.2 CON5.2 CON4.2 CON3.2 CON2.2 20.32,109.86 | CON16.2 CON17.2 | CON17.2 217.81,156.84 CON18.2 189.87,156.84 | 189.87,156.84 CON19.2 | 20.32,109.86 CON1.2 | 219.37,135.25 X1.21 | X1.4 240.37,135.25 231.78,135.25 | 219.37,135.25 231.78,135.25 | X1.6 231.97,135.25 231.78,135.25 | 215.26,135.25 210.97,135.25 X1.23 210.97,156.84 CON17.2 | 215.26,135.25 219.37,135.25 | X1.22 215.17,135.25 215.26,135.25 | C2.+ 191.13,156.84 189.87,156.84 | 20.32,109.86 C3.+
+12V
  Bottom 2.184: X1.11 X1.10
GND  (2 unrouted)
  Top 2.184: CON16.5 227.77,160.66 X1.19 227.77,135.25 | 227.77,135.25 X1.7 | 236.17,135.25 X1.5 | 236.17,135.25 X1.17 | 244.57,135.25 X1.15 | 244.57,135.25 X1.3 | 236.17,135.25 244.57,135.25 | 227.77,135.25 206.77,135.25 | 227.77,135.25 232.41,135.25 | 232.41,135.25 236.17,135.25 | X1.18 231.97,135.25 232.41,135.25 | 206.77,135.25 X1.24 | 206.77,135.25 205.1,135.25 200.03,130.18 192.28,130.18 C4.- C1.-
  Bottom 1.676: CON1.4 CON1.5 CON1.6 | CON2.4 CON2.5 CON2.6 | CON3.4 CON3.5 CON3.6 | CON4.4 CON4.5 CON4.6 | CON5.4 CON5.5 CON5.6 | CON6.4 CON6.5 CON6.6 | CON7.4 CON7.5 CON7.6 | CON10.6 CON10.5 CON10.4 | CON9.6 CON9.5 CON9.4 | CON11.4 CON11.5 CON11.6 | CON8.4 CON8.5 CON8.6 | CON13.6 CON13.5 CON13.4 | CON16.5 CON16.6 | CON16.5 CON16.4 234.95,160.66 234.31,160.66 CON16.5 | CON17.6 CON17.5 CON17.4 | 198.75,160.66 CON18.6 | CON18.5 CON18.4 | CON19.4 CON19.5 CON19.6
  Bottom 1.93: 234.31,160.66 257.81,160.66 arc-90 CON20.5 282.57,135.25 | 282.57,134.62 arc-90 CON20.4 | 282.57,134.62 arc90 CON20.6 | 282.57,135.25 282.57,134.62 | CON15.5 CON15.4 | CON15.5 CON15.6 | CON14.6 CON14.5 CON14.4 | CON13.4 CON13.5 CON15.5 | CON15.5 255.27,106.05 arc90 282.57,133.35 282.57,135.25
  Bottom 2.184: 20.32,106.05 CON2.5 35.56,106.05 | 20.32,106.05 CON1.5 | 35.56,106.05 CON3.5 CON4.5 CON5.5 CON6.5 CON7.5 CON8.5 CON9.5 CON10.5 CON11.5 CON12.5 CON13.5 CON14.5 CON15.5 | CON16.5 CON17.5 207.01,160.66 | 207.01,160.66 CON18.5 198.75,160.66 191.13,160.66 | 191.13,160.66 CON19.5 | 191.13,160.66 C2.- | 207.01,160.66 C6.- | 20.32,106.05 C3.- | 35.56,106.05 C5.-
IRQ0  (15 unrouted)
  Bottom 0.61: CON20.37 328.3,139.7 arc90 261.62,206.38 CON16.37 218.44,206.38 CON17.37 CON18.37 CON19.37
IRQ1  (15 unrouted)
  Bottom 0.61: CON20.38 329.56,139.7 arc90 261.62,207.65 CON16.38 CON17.38 CON18.38 CON19.38
IRQ2  (15 unrouted)
  Bottom 0.61: CON20.39 330.83,139.7 arc90 261.62,208.91 CON16.39 CON17.39 201.93,208.91 CON18.39 CON19.39
IRQ3  (15 unrouted)
  Bottom 0.61: CON20.40 332.11,139.7 arc90 261.62,210.19 CON16.40 CON17.40 CON18.40 CON19.40
N$10  (14 unrouted)
  Bottom 0.61: CON19.10 CON18.10 CON17.10 CON16.10 261.62,167 arc-90 288.93,139.7 CON20.10 288.93,132.08 arc-90 256.54,99.69 CON15.10
N$11  (14 unrouted)
  Bottom 0.61: CON19.11 CON18.11 CON17.11 CON16.11 261.62,168.28 arc-90 290.19,139.7 CON20.11 290.19,132.08 arc-90 256.54,98.42 CON15.11
N$12  (14 unrouted)
  Bottom 0.61: CON19.12 CON18.12 CON17.12 CON16.12 261.62,169.54 arc-90 291.46,139.7 CON20.12 291.46,132.08 arc-90 256.54,97.16 CON15.12
N$13  (14 unrouted)
  Bottom 0.61: CON19.13 CON18.13 CON17.13 CON16.13 261.62,170.81 arc-90 292.74,139.7 CON20.13 292.74,132.08 arc-90 256.54,95.89 CON15.13
N$14  (14 unrouted)
  Bottom 0.61: CON19.14 CON18.14 CON17.14 CON16.14 261.62,172.09 arc-90 294,139.7 CON20.14 294,132.08 arc-90 256.54,94.61 CON15.14
N$15  (14 unrouted)
  Bottom 0.61: CON19.15 CON18.15 CON17.15 CON16.15 261.62,173.35 arc-90 295.27,139.7 CON20.15 295.27,132.08 arc-90 256.54,93.34 CON15.15
N$16  (14 unrouted)
  Bottom 0.61: CON19.16 CON18.16 CON17.16 CON16.16 261.62,174.62 arc-90 296.55,139.7 CON20.16 296.55,132.08 arc-90 256.54,92.08 CON15.16
N$17  (14 unrouted)
  Bottom 0.61: CON19.17 CON18.17 CON17.17 CON16.17 261.62,175.9 arc-90 297.81,139.7 CON20.17 297.81,132.08 arc-90 256.54,90.81 CON15.17
N$18  (14 unrouted)
  Bottom 0.61: CON19.18 CON18.18 CON17.18 CON16.18 260.99,177.16 arc-90 299.08,139.06 | 299.08,139.06 CON20.18 299.08,132.08 arc-90 256.54,89.53 CON15.18 | 299.08,139.06 299.08,139.7
N$19  (14 unrouted)
  Bottom 0.61: CON19.19 CON18.19 CON17.19 CON16.19 261.62,178.44 arc-90 300.36,139.7 CON20.19 300.36,132.08 arc-90 256.54,88.27 CON15.19
N$20  (14 unrouted)
  Bottom 0.61: CON19.20 CON18.20 CON17.20 CON16.20 261.62,179.71 arc-90 301.62,139.7 CON20.20 301.62,132.08 arc-90 256.54,87 CON15.20
N$21  (15 unrouted)
  Bottom 0.61: CON19.21 CON18.21 CON17.21 CON16.21 261.62,180.97 arc-90 302.89,139.7 CON20.21 302.89,132.08
N$22  (15 unrouted)
  Bottom 0.61: CON19.22 CON18.22 CON17.22 CON16.22 261.62,182.25 arc-90 304.17,139.7 CON20.22 304.17,132.08
N$23  (15 unrouted)
  Bottom 0.61: CON19.23 CON18.23 CON17.23 CON16.23 261.62,183.51 arc-90 305.44,139.7 CON20.23 305.44,132.08
N$24  (15 unrouted)
  Bottom 0.61: CON19.24 CON18.24 CON17.24 CON16.24 261.62,184.78 arc-90 306.7,139.7 CON20.24 306.7,132.08
N$25  (15 unrouted)
  Bottom 0.61: CON19.25 CON18.25 CON17.25 CON16.25 261.62,186.06 arc-90 307.98,139.7 CON20.25 307.98,132.08
N$26  (15 unrouted)
  Bottom 0.61: CON19.26 CON18.26 CON17.26 CON16.26 261.62,187.32 arc-90 309.25,139.7 CON20.26 309.25,132.08
N$27  (15 unrouted)
  Bottom 0.61: CON19.27 CON18.27 CON17.27 CON16.27 261.62,188.59 arc-90 310.51,139.7 CON20.27 310.51,132.08
N$28  (15 unrouted)
  Bottom 0.61: CON19.28 CON18.28 CON17.28 CON16.28 261.62,189.87 arc-90 311.79,139.7 CON20.28 311.79,132.08
N$29  (15 unrouted)
  Bottom 0.61: CON19.29 CON18.29 CON17.29 CON16.29 261.62,191.13 arc-90 313.06,139.7 CON20.29 313.06,132.08
N$30  (15 unrouted)
  Bottom 0.61: CON19.30 CON18.30 CON17.30 CON16.30 261.62,192.41 arc-90 314.32,139.7 CON20.30 314.32,132.08
N$31  (14 unrouted)
  Bottom 0.61: CON19.31 CON18.31 CON17.31 CON16.31 261.62,193.68 arc-90 315.6,139.7 CON20.31 315.6,132.08 arc-90 256.54,73.03 CON15.31
N$32  (15 unrouted)
  Bottom 0.61: CON19.32 CON18.32 CON17.32 CON16.32 261.62,194.94 arc-90 316.87,139.7 CON20.32 316.87,132.08
N$33  (15 unrouted)
  Bottom 0.61: CON19.33 CON18.33 CON17.33 CON16.33 261.62,196.22 arc-90 318.13,139.7 CON20.33 318.13,132.08
N$34  (15 unrouted)
  Bottom 0.61: CON19.34 CON18.34 CON17.34 CON16.34 261.62,197.49 arc-90 319.4,139.7 CON20.34 319.4,132.08
N$35  (15 unrouted)
  Bottom 0.61: CON19.35 CON18.35 CON17.35 CON16.35 261.62,198.75 arc-90 320.68,139.7 CON20.35 320.68,132.08
N$36  (14 unrouted)
  Bottom 0.61: CON19.36 CON18.36 CON17.36 CON16.36 261.62,200.03 arc-90 321.94,139.7 CON20.36 321.94,132.08 arc-90 256.54,66.67 CON15.36
N$41  (15 unrouted)
  Bottom 0.61: CON20.41 333.38,139.7 arc90 261.62,211.46 CON16.41 CON17.41 CON18.41 CON19.41
N$42  (15 unrouted)
  Bottom 0.61: CON20.42 334.64,139.7 arc90 261.62,212.72 CON16.42 CON17.42 CON18.42 CON19.42
N$43  (16 unrouted)
  Bottom 0.61: CON20.43 335.92,139.7 | CON18.43 CON19.43 CON18.43 | CON18.43 CON17.43 | CON17.43 CON16.43 CON17.43
N$44  (15 unrouted)
  Bottom 0.61: CON20.44 337.19,139.7 arc90 261.62,215.26 CON16.44 | CON17.44 CON18.44 CON19.44 | CON17.44 CON16.44 | CON17.44 CON16.44
N$45  (16 unrouted)
  Bottom 0.61: CON16.45 257.81,216.53 | CON20.45 338.45,139.7 | CON17.45 CON18.45 CON19.45 | CON17.45 CON16.45 | CON17.45 CON16.45
N$46  (15 unrouted)
  Bottom 0.61: CON20.46 339.73,139.7 arc90 261.62,217.81 CON16.46 CON17.46 CON18.46 CON19.46
N$47  (16 unrouted)
  Bottom 0.61: CON20.47 341,139.7 | CON16.47 CON17.47 CON18.47 CON19.47
N$48  (16 unrouted)
  Bottom 0.61: CON20.48 342.26,139.7 arc90 261.62,220.34 CON16.48 CON17.48 CON18.48
N$49  (17 unrouted)
  Bottom 0.61: CON20.49 343.54,139.7 | 216.53,221.62 CON17.49 | 216.53,221.62 CON16.49 | CON18.49 216.53,221.62
N$50  (17 unrouted)
  Bottom 0.61: 261.62,222.88 CON16.50 CON17.50 CON18.50 | CON20.50 344.81,139.7
N$51  (17 unrouted)
  Bottom 0.61: CON20.51 346.07,139.7 | CON16.51 CON17.51 CON18.51
N$52  (16 unrouted)
  Bottom 0.61: CON20.52 347.35,139.7 arc90 261.62,225.43 CON16.52 CON17.52 CON18.52
N$53  (17 unrouted)
  Bottom 0.61: CON18.53 CON17.53 | CON16.53 261.62,226.69 arc-90 348.62,139.7 CON20.53
N$54  (19 unrouted)
N$55  (19 unrouted)
N$56  (19 unrouted)
N$57  (19 unrouted)
N$58  (19 unrouted)
N$59  (18 unrouted)
  Bottom 0.61: CON16.59 261.62,234.31 arc-90 356.24,139.7 CON20.59
N$60  (18 unrouted)
  Bottom 0.61: CON16.60 261.62,235.59 arc-90 357.5,139.7 CON20.60
N$61  (19 unrouted)
N$62  (19 unrouted)
N$63  (19 unrouted)
N$64  (19 unrouted)
N$65  (19 unrouted)
N$66  (19 unrouted)
N$67  (19 unrouted)
N$68  (18 unrouted)
  Bottom 0.61: CON16.68 261.62,245.75 arc-90 367.67,139.7 CON20.68
N$69  (19 unrouted)
N$70  (19 unrouted)
N$71  (19 unrouted)
N$72  (18 unrouted)
  Bottom 0.61: CON16.72 261.62,250.82 arc-90 372.75,139.7 CON20.72